# Altium project Mixer.PrjPCB
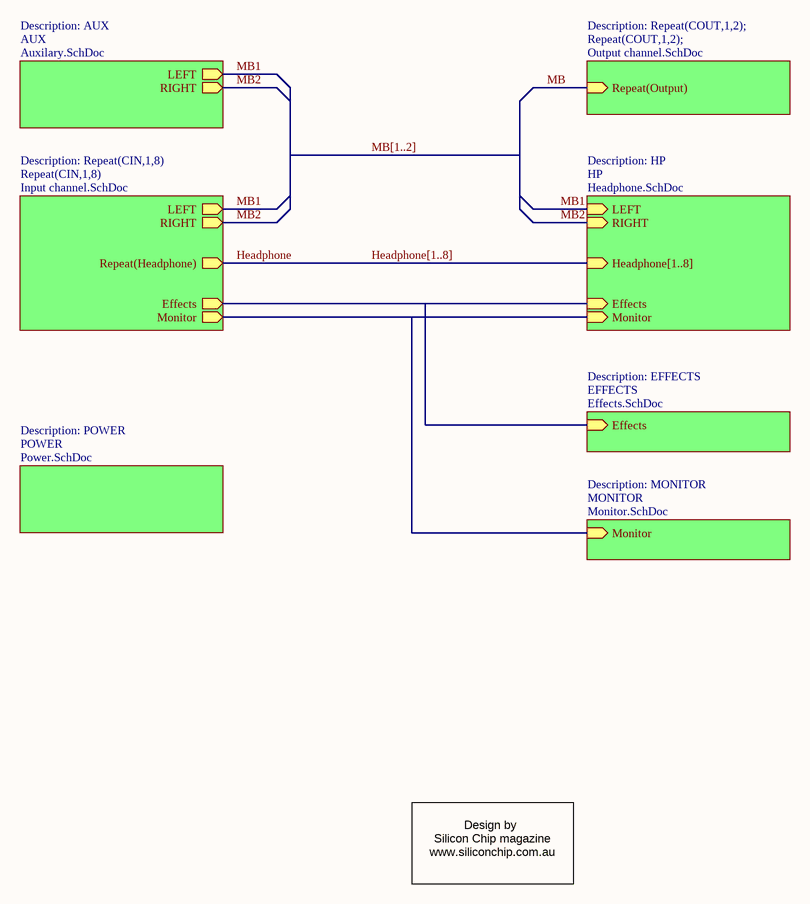
[diagram p0: Mixer.SchDoc]
8 sheets, 523 parts. Net scope: hierarchical (ports join the sheet entries above them; power ports are global).
Board files: Mixer_Blank.PCBDOC, Mixer_Loaded.PCBDOC, Mixer_Placed.PCBDOC, Mixer_RoomsOnly.PCBDOC, Mixer_Routed.PCBDOC
Sheets:
  Mixer.SchDoc
    AUX = Auxilary.SchDoc
    CIN1 = Input channel.SchDoc
    CIN2 = Input channel.SchDoc
    CIN3 = Input channel.SchDoc
    CIN4 = Input channel.SchDoc
    CIN5 = Input channel.SchDoc
    CIN6 = Input channel.SchDoc
    CIN7 = Input channel.SchDoc
    CIN8 = Input channel.SchDoc
    MONITOR = Monitor.SchDoc
    EFFECTS = Effects.SchDoc
    HP = Headphone.SchDoc
    POWER = Power.SchDoc
    Repeat(COUT,1,2); = Output channel.SchDoc

## Sheet Mixer.SchDoc
size A4; Organization: Altium Limited; Address1: L3, 12a Rodborough Rd; Address2: Frenchs Forest; Address3: NSW; Address4: Australia 2086; DocumentNumber: 5; SheetNumber: 5; SheetTotal: 8

### Sub-sheets
AUX = Auxilary.SchDoc: LEFT, RIGHT  | Description: AUX
EFFECTS = Effects.SchDoc: Effects  | Description: EFFECTS
HP = Headphone.SchDoc: Headphone[1..8] (in), Monitor, Effects, LEFT, RIGHT  | Description: HP
MONITOR = Monitor.SchDoc: Monitor  | Description: MONITOR
POWER = Power.SchDoc: no entries  | Description: POWER
Repeat(CIN,1,8) = Input channel.SchDoc: Monitor, LEFT, Repeat(Headphone) (out), Effects, RIGHT  | Description: Repeat(CIN,1,8)
Repeat(COUT,1,2); = Output channel.SchDoc: Repeat(Output)  | Description: Repeat(COUT,1,2);

### Nets
Headphone: sheet Repeat(CIN,1,8)/Repeat(Headphone)
MB1: sheet AUX/LEFT, sheet Repeat(CIN,1,8)/LEFT, sheet HP/LEFT
MB2: sheet AUX/RIGHT, sheet Repeat(CIN,1,8)/RIGHT, sheet HP/RIGHT
NetR29_1: sheet Repeat(CIN,1,8)/Monitor, sheet MONITOR/Monitor, sheet HP/Monitor
NetR33_1: sheet Repeat(CIN,1,8)/Effects, sheet EFFECTS/Effects, sheet HP/Effects

### Buses and harness runs
bus Headphone[1..8] = sheet HP/Headphone[1..8]
bus MB[1..2]

### Notes on the sheet
- Design by
  Silicon Chip magazine
  www.siliconchip.com.au
- Title
- Size:
- Date:
- A4
- Number:
- Time:
- Revision:
- Sheet
- of
- File:

## Sheet Auxilary.SchDoc
size A4; Organization: Altium Limited; Address1: L3, 12a Rodborough Rd; Address2: Frenchs Forest; Address3: NSW; Address4: Australia 2086; DocumentNumber: 1; SheetNumber: 1; SheetTotal: 8
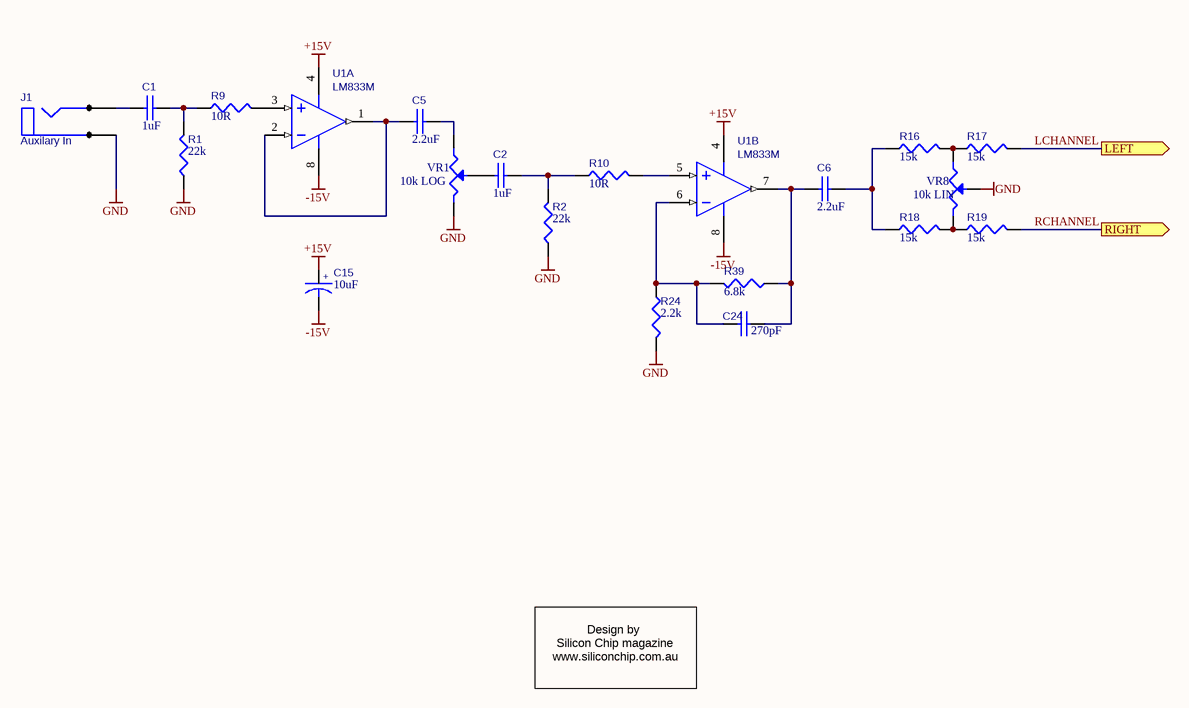
[diagram p1: Auxilary.SchDoc]

### Parts
C1  1uF  [RB.2/.4-NP]
C2  1uF  [RB.2/.4-NP]
C5  2.2uF  [RB.2/.4-NP]
C6  2.2uF  [RB.2/.4-NP]
C15  10uF  [RB.2/.4]
C24  270pF  [RAD0.2]
J1  Auxilary In  [JACK-6.25MM]
R1  22k  [AXIAL0.4]
R2  22k  [AXIAL0.4]
R9  10R  [AXIAL0.4]
R10  10R  [AXIAL0.4]
R16  15k  [AXIAL0.4]
R17  15k  [AXIAL0.4]
R18  15k  [AXIAL0.4]
R19  15k  [AXIAL0.4]
R24  2.2k  [AXIAL0.4]
R39  6.8k  [AXIAL0.4]
U1  LM833M  [DIP8]  (parts A,B of 2)
VR1  10k LOG  [POT - 24MM]
VR8  10k LIN  [POT - 24MM]

### Ports
LEFT (out), RIGHT (out)

### Nets
+15V: C15.1 U1.4(V-)
-15V: C15.2 U1.8(V+)
GND: J1.3(C) R1.1 R2.1 R24.2 VR1.3 VR8.2(W)
LCHANNEL: R17.2 ; port LEFT  [project net MB1]
RCHANNEL: R19.2 ; port RIGHT  [project net MB2]
NetC1_1: C1.1 J1.1(A)
NetC1_2: C1.2 R1.2 R9.1
NetC2_1: C2.1 VR1.2(W)
NetC2_2: C2.2 R2.2 R10.1
NetC5_1: C5.1 U1.1(OUT1) U1.2(IN1-)
NetC5_2: C5.2 VR1.1
NetC6_1: C6.1 C24.2 R39.1 U1.7(OUT2)
NetC6_2: C6.2 R16.1 R18.1
NetC24_1: C24.1 R24.1 R39.2 U1.6(IN2-)
NetR9_2: R9.2 U1.3(IN1+)
NetR10_2: R10.2 U1.5(IN2+)
NetR16_2: R16.2 R17.1 VR8.1
NetR18_2: R18.2 R19.1 VR8.3

### Notes on the sheet
- Design by
  Silicon Chip magazine
  www.siliconchip.com.au
- Title
- Size:
- Date:
- A4
- Number:
- Time:
- Revision:
- Sheet
- of
- File:
- (in symbol CAPACITOR POL) +

### Library data of the parts
C1 C2 C5 C6 C24 = CAP: Capacitor
  C24: Value: 270pF
C15 = CAPACITOR POL: Bi-Polar Capacitor; Value: 10uF
J1 = PHONEJACK MONO
R1 R2 R9 R10 R16-R19 R24 R39 = RES1: Resistor
  R1 R2: Value: 22k
  R9 R10: Value: 10R
  R16-R19: Value: 15k
  R24: Value: 2.2k
  R39: Value: 6.8k
U1 = LM833M: Fast Settling Dual Operational Amplifier
VR1 VR8 = POT1: Potentiometer

## Sheet Input channel.SchDoc
size A4; Organization: Altium Limited; Address1: L3, 12a Rodborough Rd; Address2: Frenchs Forest; Address3: NSW; Address4: Australia 2086; DocumentNumber: 4; SheetNumber: 4; SheetTotal: 8
Used 8 times, as channels CIN1, CIN2, CIN3, CIN4, CIN5, CIN6, CIN7, CIN8. Parts and nets are listed once, with the designators drawn on the sheet.
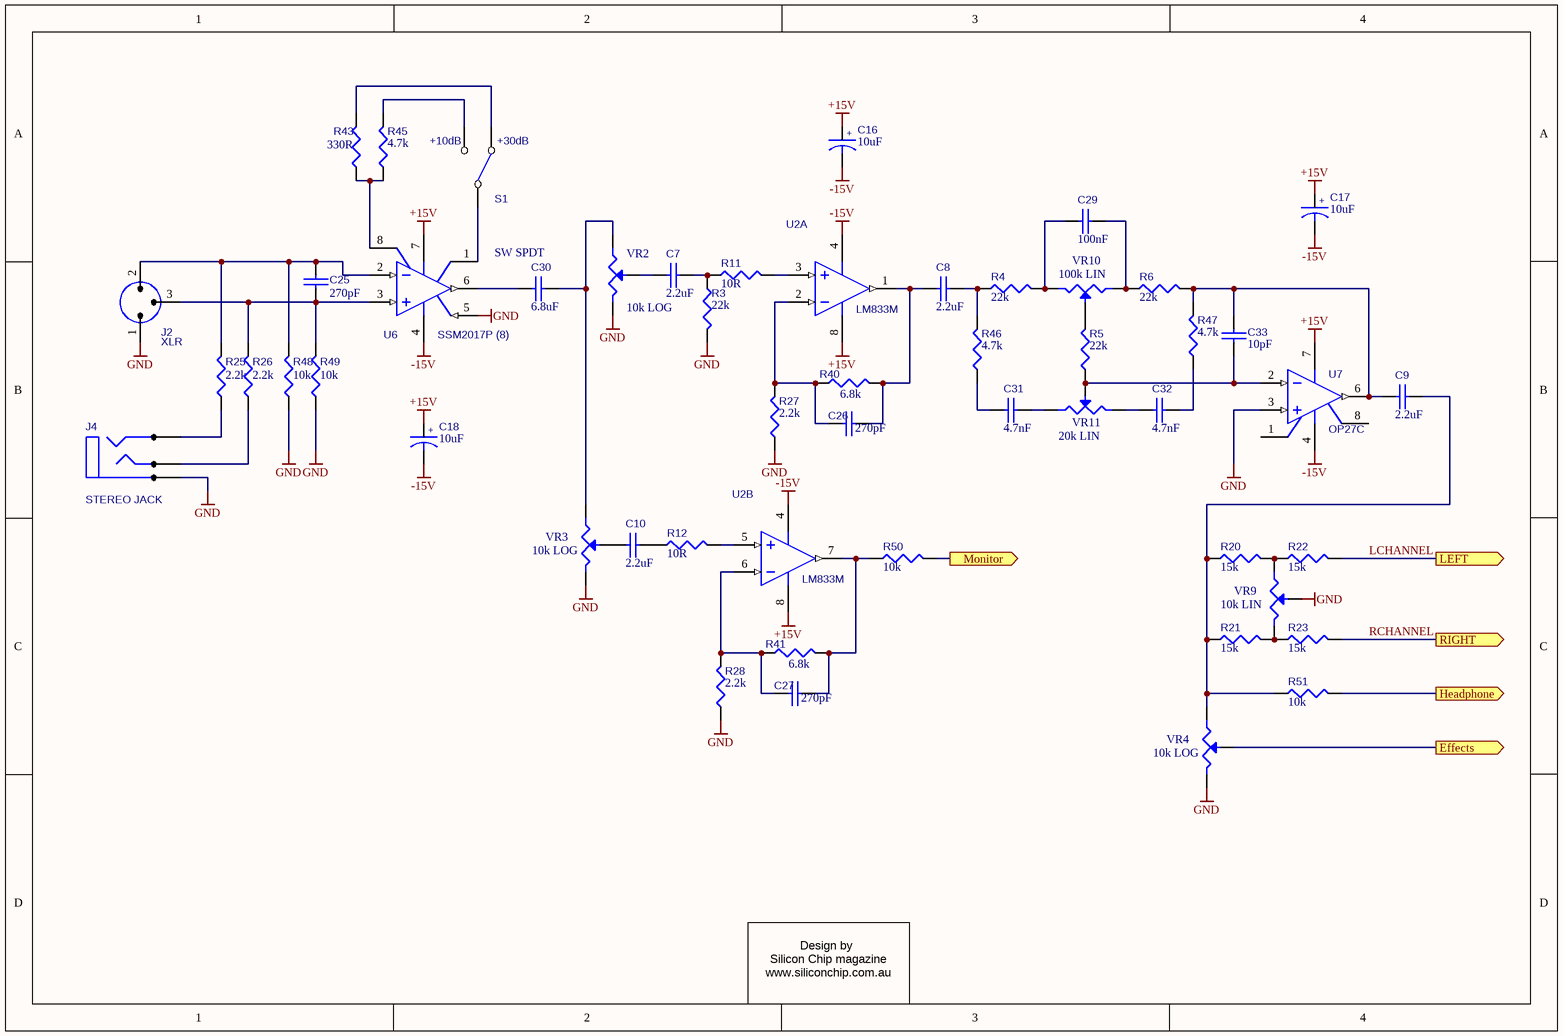
[diagram p2: Input channel.SchDoc]

### Parts
C7  2.2uF  [RB.2/.4-NP]
C8  2.2uF  [RB.2/.4-NP]
C9  2.2uF  [RB.2/.4-NP]
C10  2.2uF  [RB.2/.4-NP]
C16  10uF  [RB.2/.4]
C17  10uF  [RB.2/.4]
C18  10uF  [RB.2/.4]
C25  270pF  [RAD0.2]
C26  270pF  [RAD0.2]
C27  270pF  [RAD0.2]
C29  100nF  [RAD0.2]
C30  6.8uF  [RB.2/.4-NP]
C31  4.7nF  [RAD0.2]
C32  4.7nF  [RAD0.2]
C33  10pF  [RAD0.2]
J2  XLR  [XLR-FEMALE]
J4  STEREO JACK  [JACK-6.25MM]
R3  22k  [AXIAL0.4]
R4  22k  [AXIAL0.4]
R5  22k  [AXIAL0.4]
R6  22k  [AXIAL0.4]
R11  10R  [AXIAL0.4]
R12  10R  [AXIAL0.4]
R20  15k  [AXIAL0.4]
R21  15k  [AXIAL0.4]
R22  15k  [AXIAL0.4]
R23  15k  [AXIAL0.4]
R25  2.2k  [AXIAL0.4]
R26  2.2k  [AXIAL0.4]
R27  2.2k  [AXIAL0.4]
R28  2.2k  [AXIAL0.4]
R40  6.8k  [AXIAL0.4]
R41  6.8k  [AXIAL0.4]
R43  330R  [AXIAL0.4]
R45  4.7k  [AXIAL0.4]
R46  4.7k  [AXIAL0.4]
R47  4.7k  [AXIAL0.4]
R48  10k  [AXIAL0.4]
R49  10k  [AXIAL0.4]
R50  10k  [AXIAL0.4]
R51  10k  [AXIAL0.4]
S1  SW SPDT  [SW-SPDT]
U2  LM833M  [DIP8]  (parts A,B of 2)
U6  SSM2017P (8)  [DIP8]
U7  OP27C  [DIP8]
VR2  10k LOG  [POT - 24MM]
VR3  10k LOG  [POT - 24MM]
VR4  10k LOG  [POT - 24MM]
VR9  10k LIN  [POT - 24MM]
VR10  100k LIN  [POT - 24MM]
VR11  20k LIN  [POT - 24MM]

### Ports
Effects (out), Headphone (out), LEFT (out), Monitor (out), RIGHT (out)

### Nets
+15V: C16.1 C17.1 C18.1 U2.8(V+) U6.7(V+) U7.7(V+)
-15V: C16.2 C17.2 C18.2 U2.4(V-) U6.4(V-) U7.4(V-)
GND: J2.1 J4.3(C) R3.2 R27.1 R28.1 R48.1 R49.1 U6.5(REF) U7.3(+IN) VR2.3 VR3.3 VR4.3 VR9.2(W)
Effects: VR4.2(W) ; port Effects
Headphone: R51.2 ; port Headphone
LCHANNEL: R22.2 ; port LEFT
Monitor: R50.2 ; port Monitor
RCHANNEL: R23.2 ; port RIGHT
NetC7_1: C7.1 VR2.2(W)
NetC7_2: C7.2 R3.1 R11.1
NetC8_1: C8.1 C26.2 R40.2 U2.1(OUT1)
NetC8_2: C8.2 R4.1 R46.2
NetC9_1: C9.1 C33.2 R6.2 R47.2 U7.6(OUT)
NetC9_2: C9.2 R20.1 R21.1 R51.1 VR4.1
NetC10_1: C10.1 VR3.2(W)
NetC10_2: C10.2 R12.1
NetC25_1: C25.1 J2.2 R25.2 R48.2 U6.2(IN-)
NetC25_2: C25.2 J2.3 R26.2 R49.2 U6.3(IN+)
NetC26_1: C26.1 R27.2 R40.1 U2.2(IN1-)
NetC27_1: C27.1 R28.2 R41.1 U2.6(IN2-)
NetC27_2: C27.2 R41.2 R50.1 U2.7(OUT2)
NetC29_1: C29.1 R4.2 VR10.3
NetC29_2: C29.2 R6.1 VR10.1
NetC30_1: C30.1 U6.6(OUT)
NetC30_2: C30.2 VR2.1 VR3.1
NetC31_1: C31.1 R46.1
NetC31_2: C31.2 VR11.1
NetC32_1: C32.1 VR11.3
NetC32_2: C32.2 R47.1
NetC33_1: C33.1 R5.1 U7.2(-IN) VR11.2(W)
NetJ4_1: J4.1(A) R25.1
NetJ4_2: J4.2(B) R26.1
NetR5_2: R5.2 VR10.2(W)
NetR11_2: R11.2 U2.3(IN1+)
NetR12_2: R12.2 U2.5(IN2+)
NetR20_2: R20.2 R22.1 VR9.1
NetR21_2: R21.2 R23.1 VR9.3
NetR43_1: R43.1 R45.1 U6.8(RG2)
NetR43_2: R43.2 S1.2(NC)
NetR45_2: R45.2 S1.3(NO)
NetS1_1: S1.1(COMMON) U6.1(RG1)

Not connected (* = marked no-connect by the designer): U7 1(TRIM) 8(TRIM)

### Channels
CIN1: designators end in _CIN1; ports Effects=NetR33_1 Headphone=Headphone1 LEFT=MB1 Monitor=NetR29_1 RIGHT=MB2
CIN2: designators end in _CIN2; ports Effects=NetR33_1 Headphone=Headphone2 LEFT=MB1 Monitor=NetR29_1 RIGHT=MB2
CIN3: designators end in _CIN3; ports Effects=NetR33_1 Headphone=Headphone3 LEFT=MB1 Monitor=NetR29_1 RIGHT=MB2
CIN4: designators end in _CIN4; ports Effects=NetR33_1 Headphone=Headphone4 LEFT=MB1 Monitor=NetR29_1 RIGHT=MB2
CIN5: designators end in _CIN5; ports Effects=NetR33_1 Headphone=Headphone5 LEFT=MB1 Monitor=NetR29_1 RIGHT=MB2
CIN6: designators end in _CIN6; ports Effects=NetR33_1 Headphone=Headphone6 LEFT=MB1 Monitor=NetR29_1 RIGHT=MB2
CIN7: designators end in _CIN7; ports Effects=NetR33_1 Headphone=Headphone7 LEFT=MB1 Monitor=NetR29_1 RIGHT=MB2
CIN8: designators end in _CIN8; ports Effects=NetR33_1 Headphone=Headphone8 LEFT=MB1 Monitor=NetR29_1 RIGHT=MB2

### Notes on the sheet
- (near S1) +10dB
- (near S1) +30dB
- Design by
  Silicon Chip magazine
  www.siliconchip.com.au
- Title
- Size:
- Date:
- A4
- Number:
- Time:
- Revision:
- Sheet
- of
- File:
- (in symbol CAPACITOR POL) +

### Library data of the parts
C7-C10 C25-C27 C29-C33 = CAP: Capacitor
  C26 C27: Value: 270pF
C16-C18 = CAPACITOR POL: Bi-Polar Capacitor; Value: 10uF
J2 = XLR: XLR connector, PCB mounted
J4 = PHONEJACK STEREO
R3-R6 R11 R12 R20-R23 R25-R28 R40 R41 R43 R45-R51 = RES1: Resistor
  R3-R6: Value: 22k
  R11 R12: Value: 10R
  R20-R23: Value: 15k
  R25-R28: Value: 2.2k
  R40 R41: Value: 6.8k
  R43: Value: 330R
  R45-R47: Value: 4.7k
  R48-R51: Value: 10k
U2 = LM833M: Fast Settling Dual Operational Amplifier
U6 = SSM2017P (8): Self-Contained Audio Preamplifier
U7 = OP27C: Low Noise, High Speed Precision Operational Amplifier
VR2-VR4 VR9-VR11 = POT1: Potentiometer

## Sheet Monitor.SchDoc
size A4; Organization: Altium Limited; Address1: L3, 12a Rodborough Rd; Address2: Frenchs Forest; Address3: NSW; Address4: Australia 2086; DocumentNumber: 6; SheetNumber: 6; SheetTotal: 8
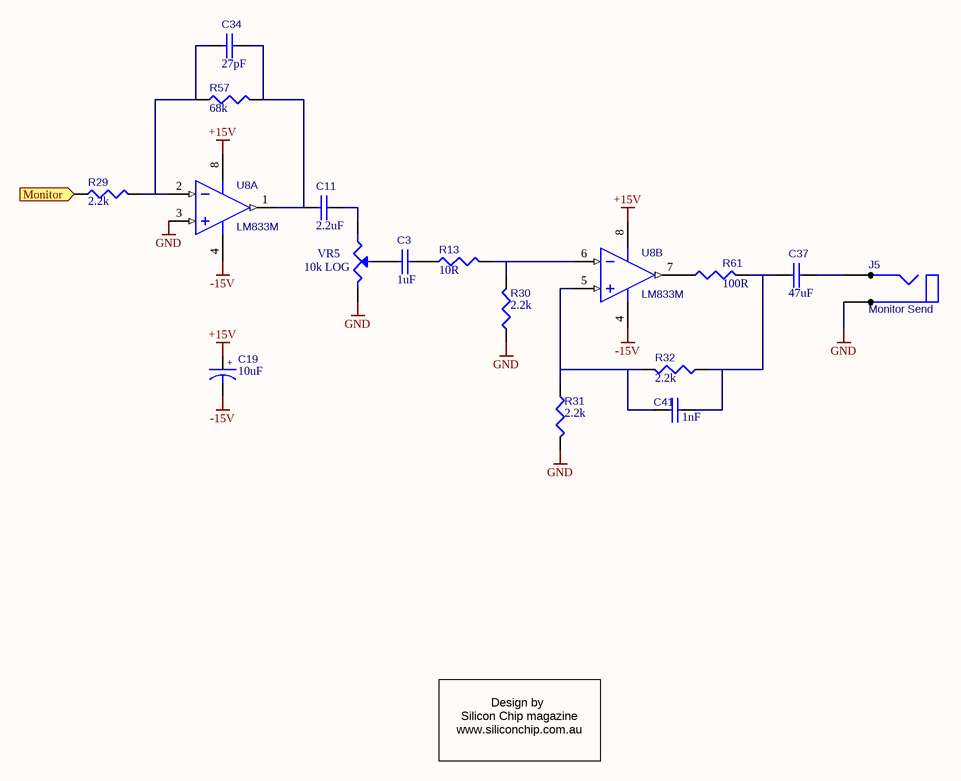
[diagram p3: Monitor.SchDoc]

### Parts
C3  1uF  [RB.2/.4-NP]
C11  2.2uF  [RB.2/.4-NP]
C19  10uF  [RB.2/.4]
C34  27pF  [RAD0.2]
C37  47uF  [RB.2/.4-NP]
C41  1nF  [RAD0.2]
J5  Monitor Send  [JACK-6.25MM]
R13  10R  [AXIAL0.4]
R29  2.2k  [AXIAL0.4]
R30  2.2k  [AXIAL0.4]
R31  2.2k  [AXIAL0.4]
R32  2.2k  [AXIAL0.4]
R57  68k  [AXIAL0.4]
R61  100R  [AXIAL0.4]
U8  LM833M  [DIP8]  (parts A,B of 2)
VR5  10k LOG  [POT - 24MM]

### Ports
Monitor (in)

### Nets
+15V: C19.1 U8.8(V+)
-15V: C19.2 U8.4(V-)
GND: J5.3(C) R30.1 R31.2 U8.3(IN1+) VR5.3
NetC3_1: C3.1 VR5.2(W)
NetC3_2: C3.2 R13.1
NetC11_1: C11.1 C34.2 R57.2 U8.1(OUT1)
NetC11_2: C11.2 VR5.1
NetC34_1: C34.1 R29.2 R57.1 U8.2(IN1-)
NetC37_1: C37.1 C41.2 R32.1 R61.2
NetC37_2: C37.2 J5.1(A)
NetC41_1: C41.1 R31.1 R32.2 U8.5(IN2+)
NetR13_2: R13.2 R30.2 U8.6(IN2-)
NetR29_1: R29.1 ; port Monitor
NetR61_1: R61.1 U8.7(OUT2)

### Notes on the sheet
- Design by
  Silicon Chip magazine
  www.siliconchip.com.au
- Title
- Size:
- Date:
- A4
- Number:
- Time:
- Revision:
- Sheet
- of
- File:
- (in symbol CAPACITOR POL) +

### Library data of the parts
C3 C11 C34 C37 C41 = CAP: Capacitor
  C34: Value: 27pF
C19 = CAPACITOR POL: Bi-Polar Capacitor; Value: 10uF
J5 = PHONEJACK MONO
R13 R29-R32 R57 R61 = RES1: Resistor
  R13: Value: 10R
  R29-R32: Value: 2.2k
  R57: Value: 68k
  R61: Value: 100R
U8 = LM833: Fast Settling Dual Operational Amplifier
VR5 = POT1: Potentiometer

## Sheet Effects.SchDoc
size A4; Organization: Altium Limited; Address1: L3, 12a Rodborough Rd; Address2: Frenchs Forest; Address3: NSW; Address4: Australia 2086; DocumentNumber: 2; SheetNumber: 2; SheetTotal: 8
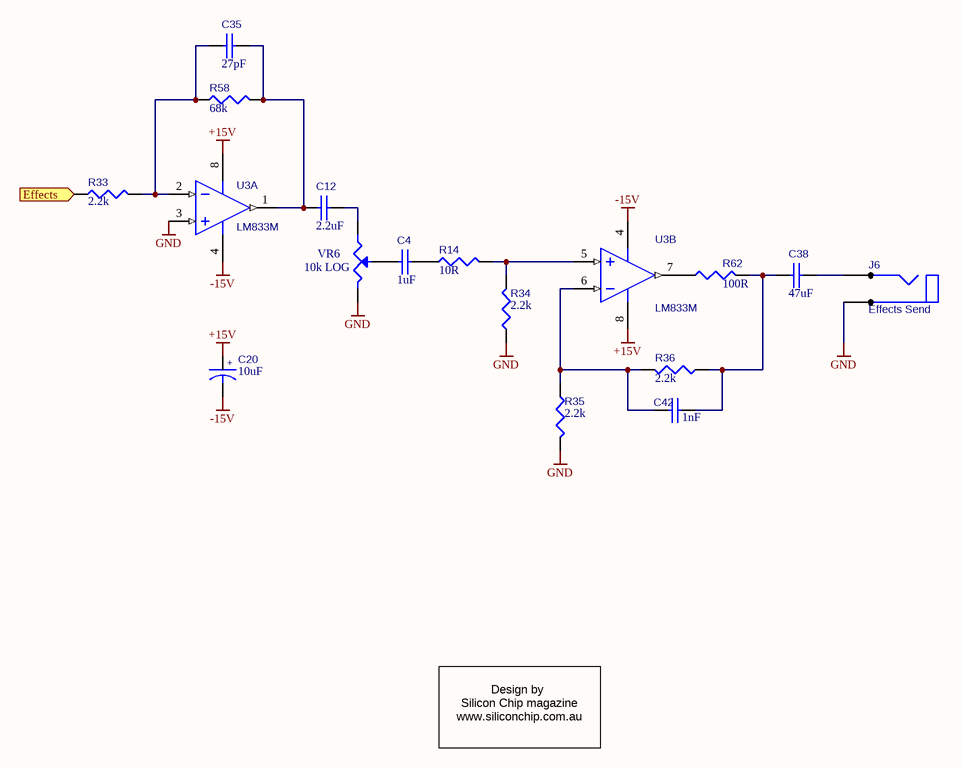
[diagram p4: Effects.SchDoc]

### Parts
C4  1uF  [RB.2/.4-NP]
C12  2.2uF  [RB.2/.4-NP]
C20  10uF  [RB.2/.4]
C35  27pF  [RAD0.2]
C38  47uF  [RB.2/.4-NP]
C42  1nF  [RAD0.2]
J6  Effects Send  [JACK-6.25MM]
R14  10R  [AXIAL0.4]
R33  2.2k  [AXIAL0.4]
R34  2.2k  [AXIAL0.4]
R35  2.2k  [AXIAL0.4]
R36  2.2k  [AXIAL0.4]
R58  68k  [AXIAL0.4]
R62  100R  [AXIAL0.4]
U3  LM833M  [DIP8]  (parts A,B of 2)
VR6  10k LOG  [POT - 24MM]

### Ports
Effects (in)

### Nets
+15V: C20.1 U3.8(V+)
-15V: C20.2 U3.4(V-)
GND: J6.3(C) R34.1 R35.2 U3.3(IN1+) VR6.3
NetC4_1: C4.1 VR6.2(W)
NetC4_2: C4.2 R14.1
NetC12_1: C12.1 C35.2 R58.2 U3.1(OUT1)
NetC12_2: C12.2 VR6.1
NetC35_1: C35.1 R33.2 R58.1 U3.2(IN1-)
NetC38_1: C38.1 C42.2 R36.1 R62.2
NetC38_2: C38.2 J6.1(A)
NetC42_1: C42.1 R35.1 R36.2 U3.6(IN2-)
NetR14_2: R14.2 R34.2 U3.5(IN2+)
NetR33_1: R33.1 ; port Effects
NetR62_1: R62.1 U3.7(OUT2)

### Notes on the sheet
- Design by
  Silicon Chip magazine
  www.siliconchip.com.au
- Title
- Size:
- Date:
- A4
- Number:
- Time:
- Revision:
- Sheet
- of
- File:
- (in symbol CAPACITOR POL) +

### Library data of the parts
C4 C12 C35 C38 C42 = CAP: Capacitor
  C42: Value: 1nF
C20 = CAPACITOR POL: Bi-Polar Capacitor; Value: 10uF
J6 = PHONEJACK MONO
R14 R33-R36 R58 R62 = RES1: Resistor
  R14: Value: 10R
  R33-R36: Value: 2.2k
  R58: Value: 68k
  R62: Value: 100R
U3 = LM833M: Fast Settling Dual Operational Amplifier
VR6 = POT1: Potentiometer

## Sheet Headphone.SchDoc
size A4; Organization: Altium Limited; Address1: L3, 12a Rodborough Rd; Address2: Frenchs Forest; Address3: NSW; Address4: Australia 2086; DocumentNumber: 3; SheetNumber: 3; SheetTotal: 8
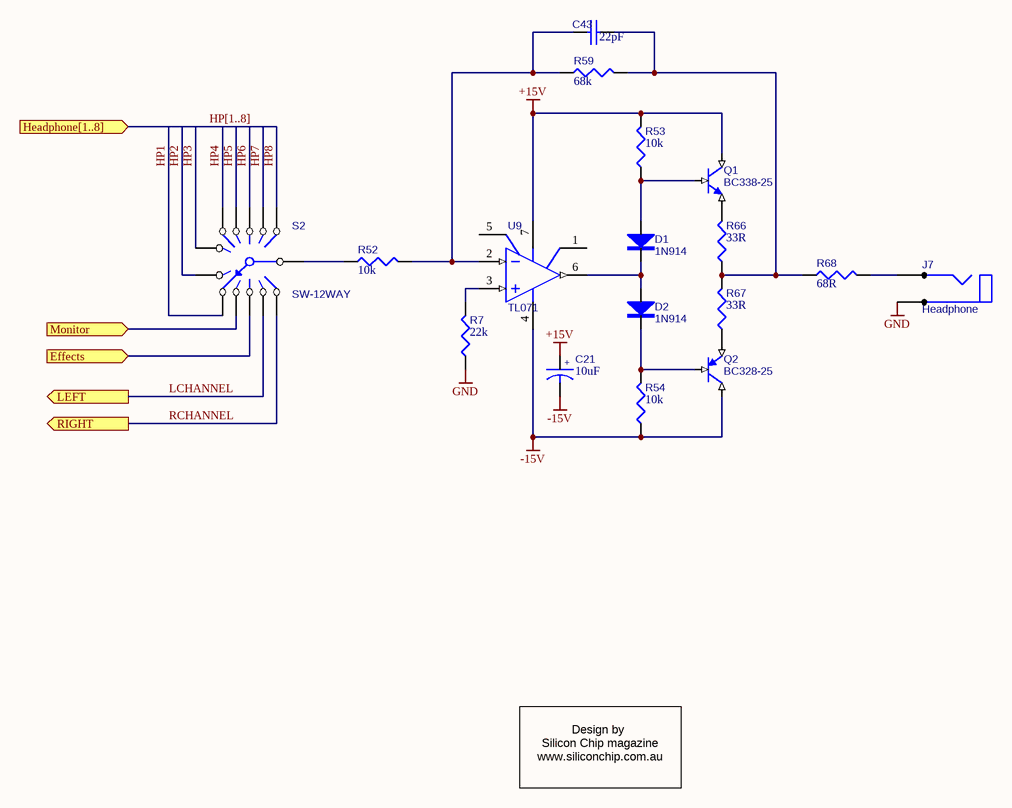
[diagram p5: Headphone.SchDoc]

### Parts
C21  10uF  [RB.2/.4]
C43  22pF  [RAD0.2]
D1  1N914  [DIODE0.4]
D2  1N914  [DIODE0.4]
J7  Headphone  [JACK-6.25MM]
Q1  BC338-25  [TO-92A]
Q2  BC328-25  [TO-92A]
R7  22k  [AXIAL0.4]
R52  10k  [AXIAL0.4]
R53  10k  [AXIAL0.4]
R54  10k  [AXIAL0.4]
R59  68k  [AXIAL0.4]
R66  33R  [AXIAL0.4]
R67  33R  [AXIAL0.4]
R68  68R  [AXIAL0.4]
S2  SW-12WAY  [SW-12WAY]
U9  TL071  [DIP8]

### Ports
Effects (in), Headphone[1..8] (in), LEFT (out), Monitor (in), RIGHT (out)

### Nets
+15V: C21.1 Q1.1(C) R53.2 U9.7(VCC+)
-15V: C21.2 Q2.1(C) R54.1 U9.4(VCC-)
GND: J7.3(C) R7.1
HP1: S2.8  [project net Headphone1]
HP2: S2.7  [project net Headphone2]
HP3: S2.6  [project net Headphone3]
HP4: S2.5  [project net Headphone4]
HP5: S2.4  [project net Headphone5]
HP6: S2.3  [project net Headphone6]
HP7: S2.2  [project net Headphone7]
HP8: S2.1  [project net Headphone8]
LCHANNEL: S2.11 ; port LEFT  [project net MB1]
RCHANNEL: S2.12 ; port RIGHT  [project net MB2]
NetC43_1: C43.1 R52.2 R59.1 U9.2(IN-)
NetC43_2: C43.2 R59.2 R66.1 R67.2 R68.1
NetD1_1: D1.1(A) Q1.2(B) R53.1
NetD1_2: D1.2(K) D2.1(A) U9.6(OUT)
NetD2_2: D2.2(K) Q2.2(B) R54.2
NetJ7_1: J7.1(A) R68.2
NetQ1_3: Q1.3(E) R66.2
NetQ2_3: Q2.3(E) R67.1
NetR7_2: R7.2 U9.3(IN+)
NetR29_1: S2.9 ; port Monitor
NetR33_1: S2.10 ; port Effects
NetR52_1: R52.1 S2.13

Not connected (* = marked no-connect by the designer): U9 1(N1/O.S.) 5(O.S._N2)

### Buses and harness runs
bus HP[1..8] = port Headphone[1..8]

### Notes on the sheet
- Design by
  Silicon Chip magazine
  www.siliconchip.com.au
- Title
- Size:
- Date:
- A4
- Number:
- Time:
- Revision:
- Sheet
- of
- File:
- (in symbol CAPACITOR POL) +

### Library data of the parts
C21 = CAPACITOR POL: Bi-Polar Capacitor; Value: 10uF
C43 = CAP: Capacitor
D1 D2 = 1N914: Diode
J7 = PHONEJACK MONO
Q1 = BC338-25: NPN BJT
Q2 = BC328-25: PNP BJT
R7 R52-R54 R59 R66-R68 = RES1: Resistor
  R7: Value: 22k
  R52-R54: Value: 10k
  R59: Value: 68k
  R66 R67: Value: 33R
  R68: Value: 68R
U9 = TL071: Low-Noise  JFET-Input Operational Amplifiers

## Sheet Power.SchDoc
size A4; Organization: Altium Limited; Address1: L3, 12a Rodborough Rd; Address2: Frenchs Forest; Address3: NSW; Address4: Australia 2086; DocumentNumber: 8; SheetNumber: 8; SheetTotal: 8
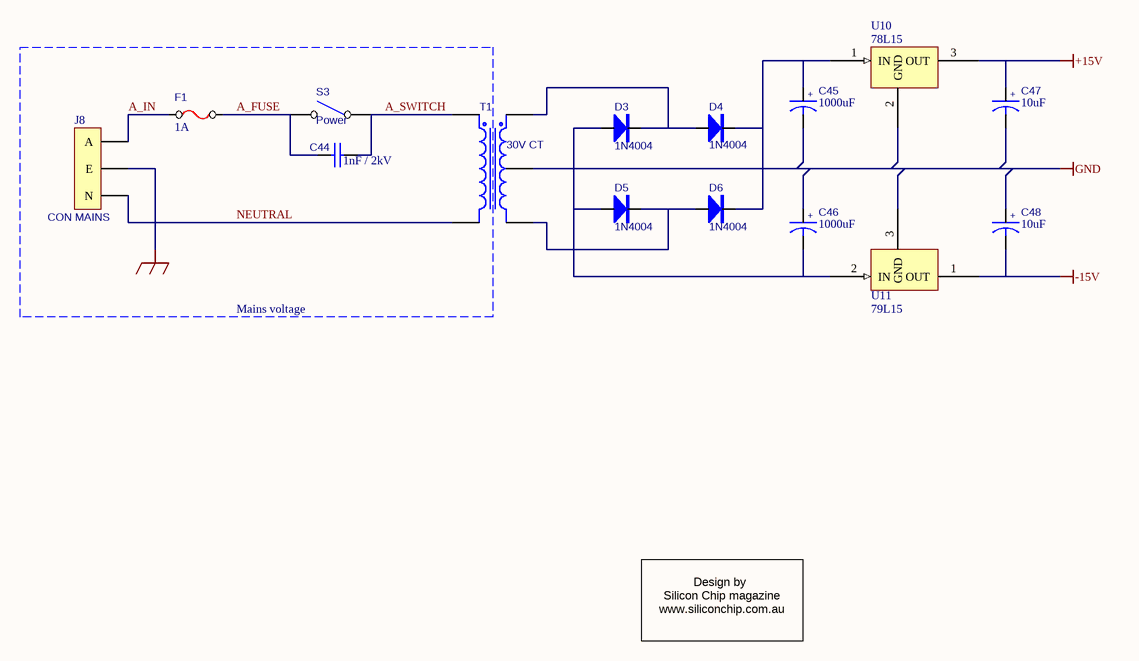
[diagram p6: Power.SchDoc]

### Parts
C44  1nF / 2kV  [RAD0.8]
C45  1000uF  [RB.4/.8]
C46  1000uF  [RB.4/.8]
C47  10uF  [RB.2/.4]
C48  10uF  [RB.2/.4]
D3  1N4004  [DIODE0.5]
D4  1N4004  [DIODE0.5]
D5  1N4004  [DIODE0.5]
D6  1N4004  [DIODE0.5]
F1  1A  [FUSE]
J8  CON MAINS  [IEC-MAINS]
S3  Power  [SW-MAINS]
T1  30V CT  [TRANSFORMER]
U10  78L15  [TO-92A]
U11  79L15  [TO-92A]

### Blocks framed on the sheet
Mains voltage: C44 F1 J8 S3

### Nets
+15V: C47.1 U10.3(OUT)
-15V: C48.2 U11.1(OUT)
CHASSIS: J8.2(E)
GND: C45.2 C46.1 C47.2 C48.1 T1.4(SecCT) U10.2(GND) U11.3(GND)
A_FUSE: C44.2 F1.2 S3.2(NO)
A_IN: F1.1 J8.1(A)
A_SWITCH: C44.1 S3.1(COMMON) T1.1(Pri+)
NEUTRAL: J8.3(N) T1.2(Pri-)
NetC45_1: C45.1 D4.2(K) D6.2(K) U10.1(IN)
NetC46_2: C46.2 D3.1(A) D5.1(A) U11.2(IN)
NetD3_2: D3.2(K) D4.1(A) T1.3(Sec+)
NetD5_2: D5.2(K) D6.1(A) T1.5(Sec-)

### Notes on the sheet
- Design by
  Silicon Chip magazine
  www.siliconchip.com.au
- Title
- Size:
- Date:
- A4
- Number:
- Time:
- Revision:
- Sheet
- of
- File:
- (in symbol CAPACITOR POL) +

### Library data of the parts
C44 = CAP: Capacitor
C45-C48 = CAPACITOR POL: Bi-Polar Capacitor
D3-D6 = 1N4004: Diode
F1 = FUSE
J8 = CON MAINS: Connector
S3 = SW SPST
T1 = 30V CT: Center-Tapped Transformer
U10 = 78L15: Very Low Drop Voltage Regulators With Inhibit
U11 = 79L15: Very Low Drop Voltage Regulators With Inhibit

## Sheet Output channel.SchDoc
size A4; Organization: Altium Limited; Address1: L3, 12a Rodborough Rd; Address2: Frenchs Forest; Address3: NSW; Address4: Australia 2086; DocumentNumber: 7; SheetNumber: 7; SheetTotal: 8
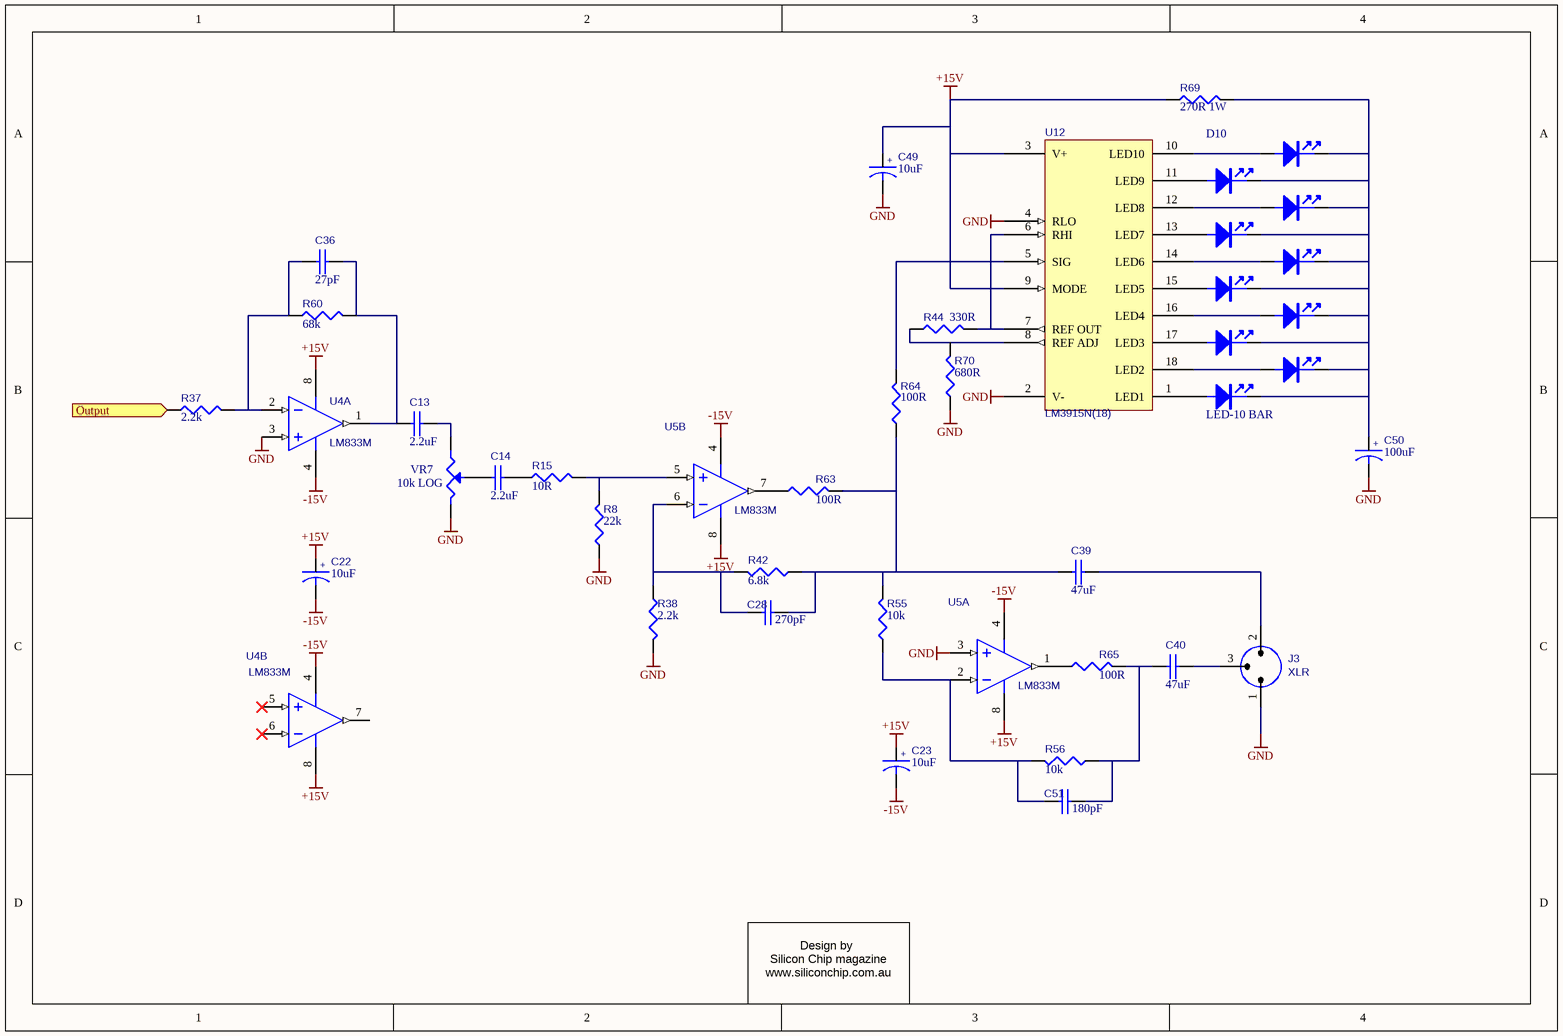
[diagram p7: Output channel.SchDoc]

### Parts
C13  2.2uF  [RB.2/.4-NP]
C14  2.2uF  [RB.2/.4-NP]
C22  10uF  [RB.2/.4]
C23  10uF  [RB.2/.4]
C28  270pF  [RAD0.2]
C36  27pF  [RAD0.2]
C39  47uF  [RB.2/.4-NP]
C40  47uF  [RB.2/.4-NP]
C49  10uF  [RB.2/.4]
C50  100uF  [RB.2/.4]
C51  180pF  [RAD0.2]
D10  LED-10 BAR  [LED - 10 BAR HORIZONTAL]
J3  XLR  [XLR-MALE]
R8  22k  [AXIAL0.4]
R15  10R  [AXIAL0.4]
R37  2.2k  [AXIAL0.4]
R38  2.2k  [AXIAL0.4]
R42  6.8k  [AXIAL0.4]
R44  330R  [AXIAL0.4]
R55  10k  [AXIAL0.4]
R56  10k  [AXIAL0.4]
R60  68k  [AXIAL0.4]
R63  100R  [AXIAL0.4]
R64  100R  [AXIAL0.4]
R65  100R  [AXIAL0.4]
R69  270R 1W  [AXIAL0.4]
R70  680R  [AXIAL0.4]
U4  LM833M  [DIP8]  (parts A,B of 2)
U5  LM833M  [DIP8]  (parts A,B of 2)
U12  LM3915N(18)  [DIP18]
VR7  10k LOG  [POT - 24MM]

### Ports
Output (in)

### Nets
+15V: C22.1 C23.1 C49.1 R69.1 U4.8(V+) U5.8(V+) U12.3(V+) U12.9(MODE)
-15V: C22.2 C23.2 U4.4(V-) U5.4(V-)
GND: C49.2 C50.2 J3.1 R8.1 R38.2 R70.1 U4.3(IN1+) U5.3(IN1+) U12.2(V-) U12.4(RLO) VR7.3
MB: R37.1 ; port Output
NetC13_1: C13.1 C36.2 R60.2 U4.1(OUT1)
NetC13_2: C13.2 VR7.1
NetC14_1: C14.1 VR7.2(W)
NetC14_2: C14.2 R15.1
NetC28_1: C28.1 R38.1 R42.2 U5.6(IN2-)
NetC28_2: C28.2 C39.1 R42.1 R55.2 R63.2 R64.1
NetC36_1: C36.1 R37.2 R60.1 U4.2(IN1-)
NetC39_2: C39.2 J3.2
NetC40_1: C40.1 C51.2 R56.1 R65.2
NetC40_2: C40.2 J3.3
NetC50_1: C50.1 D10.2(K) D10.4(K) D10.6(K) D10.8(K) D10.10(K) D10.12(K) D10.14(K) D10.16(K) D10.18(K) D10.20(K) R69.2
NetC51_1: C51.1 R55.1 R56.2 U5.2(IN1-)
NetD10_1: D10.1(A) U12.1(LED1)
NetD10_3: D10.3(A) U12.18(LED2)
NetD10_5: D10.5(A) U12.17(LED3)
NetD10_7: D10.7(A) U12.16(LED4)
NetD10_9: D10.9(A) U12.15(LED5)
NetD10_11: D10.11(A) U12.14(LED6)
NetD10_13: D10.13(A) U12.13(LED7)
NetD10_15: D10.15(A) U12.12(LED8)
NetD10_17: D10.17(A) U12.11(LED9)
NetD10_19: D10.19(A) U12.10(LED10)
NetR8_2: R8.2 R15.2 U5.5(IN2+)
NetR44_1: R44.1 R70.2 U12.8(REF_ADJ)
NetR44_2: R44.2 U12.6(RHI) U12.7(REF_OUT)
NetR63_1: R63.1 U5.7(OUT2)
NetR64_2: R64.2 U12.5(SIG)
NetR65_1: R65.1 U5.1(OUT1)

Not connected (* = marked no-connect by the designer): U4 5(IN2+)* 6(IN2-)* 7(OUT2)

### Notes on the sheet
- Design by
  Silicon Chip magazine
  www.siliconchip.com.au
- Title
- Size:
- Date:
- A4
- Number:
- Time:
- Revision:
- Sheet
- of
- File:
- (in symbol CAPACITOR POL) +

### Library data of the parts
C13 C14 C28 C36 C39 C40 C51 = CAP: Capacitor
  C36: Value: 27pF
C22 C23 C49 C50 = CAPACITOR POL: Bi-Polar Capacitor
  C23: Value: 10uF
J3 = XLR: XLR connector, PCB mounted
R8 R15 R37 R38 R42 R44 R55 R56 R60 R63-R65 R69 R70 = RES1: Resistor
  R8: Value: 22k
  R15: Value: 10R
  R37 R38: Value: 2.2k
  R42: Value: 6.8k
  R44: Value: 330R
  R55 R56: Value: 10k
  R60: Value: 68k
  R63-R65: Value: 100R
  R69: Value: 270R 1W
  R70: Value: 680R
U4 U5 = LM833M: Fast Settling Dual Operational Amplifier
U12 = LM3915N(18): Dot/Bar Display Driver
VR7 = POT1: Potentiometer

## Nets that join several sheets
+15V: Auxilary (C15.1 U1.4), CIN1 (6 pins), CIN2 (6 pins), CIN3 (6 pins), CIN4 (6 pins), CIN5 (6 pins), CIN6 (6 pins), CIN7 (6 pins), CIN8 (6 pins), Monitor (C19.1 U8.8), Effects (C20.1 U3.8), Headphone (C21.1 Q1.1 R53.2 U9.7), Power (C47.1 U10.3), Output channel (8 pins)
-15V: Auxilary (C15.2 U1.8), CIN1 (6 pins), CIN2 (6 pins), CIN3 (6 pins), CIN4 (6 pins), CIN5 (6 pins), CIN6 (6 pins), CIN7 (6 pins), CIN8 (6 pins), Monitor (C19.2 U8.4), Effects (C20.2 U3.4), Headphone (C21.2 Q2.1 R54.1 U9.4), Power (C48.2 U11.1), Output channel (C22.2 C23.2 U4.4 U5.4)
GND: Auxilary (6 pins), CIN1 (13 pins), CIN2 (13 pins), CIN3 (13 pins), CIN4 (13 pins), CIN5 (13 pins), CIN6 (13 pins), CIN7 (13 pins), CIN8 (13 pins), Monitor (5 pins), Effects (5 pins), Headphone (J7.3 R7.1), Power (7 pins), Output channel (11 pins)
Headphone1: CIN1 (R51_CIN1.2), Headphone (S2.8)
Headphone2: CIN2 (R51_CIN2.2), Headphone (S2.7)
Headphone3: CIN3 (R51_CIN3.2), Headphone (S2.6)
Headphone4: CIN4 (R51_CIN4.2), Headphone (S2.5)
Headphone5: CIN5 (R51_CIN5.2), Headphone (S2.4)
Headphone6: CIN6 (R51_CIN6.2), Headphone (S2.3)
Headphone7: CIN7 (R51_CIN7.2), Headphone (S2.2)
Headphone8: CIN8 (R51_CIN8.2), Headphone (S2.1)
MB1: Auxilary (R17.2), CIN1 (R22_CIN1.2), CIN2 (R22_CIN2.2), CIN3 (R22_CIN3.2), CIN4 (R22_CIN4.2), CIN5 (R22_CIN5.2), CIN6 (R22_CIN6.2), CIN7 (R22_CIN7.2), CIN8 (R22_CIN8.2), Headphone (S2.11)
MB2: Auxilary (R19.2), CIN1 (R23_CIN1.2), CIN2 (R23_CIN2.2), CIN3 (R23_CIN3.2), CIN4 (R23_CIN4.2), CIN5 (R23_CIN5.2), CIN6 (R23_CIN6.2), CIN7 (R23_CIN7.2), CIN8 (R23_CIN8.2), Headphone (S2.12)
NetR29_1: CIN1 (R50_CIN1.2), CIN2 (R50_CIN2.2), CIN3 (R50_CIN3.2), CIN4 (R50_CIN4.2), CIN5 (R50_CIN5.2), CIN6 (R50_CIN6.2), CIN7 (R50_CIN7.2), CIN8 (R50_CIN8.2), Monitor (R29.1), Headphone (S2.9)
NetR33_1: CIN1 (VR4_CIN1.2), CIN2 (VR4_CIN2.2), CIN3 (VR4_CIN3.2), CIN4 (VR4_CIN4.2), CIN5 (VR4_CIN5.2), CIN6 (VR4_CIN6.2), CIN7 (VR4_CIN7.2), CIN8 (VR4_CIN8.2), Effects (R33.1), Headphone (S2.10)